# EAGLE design G850L (EAGLE 6.6.0)
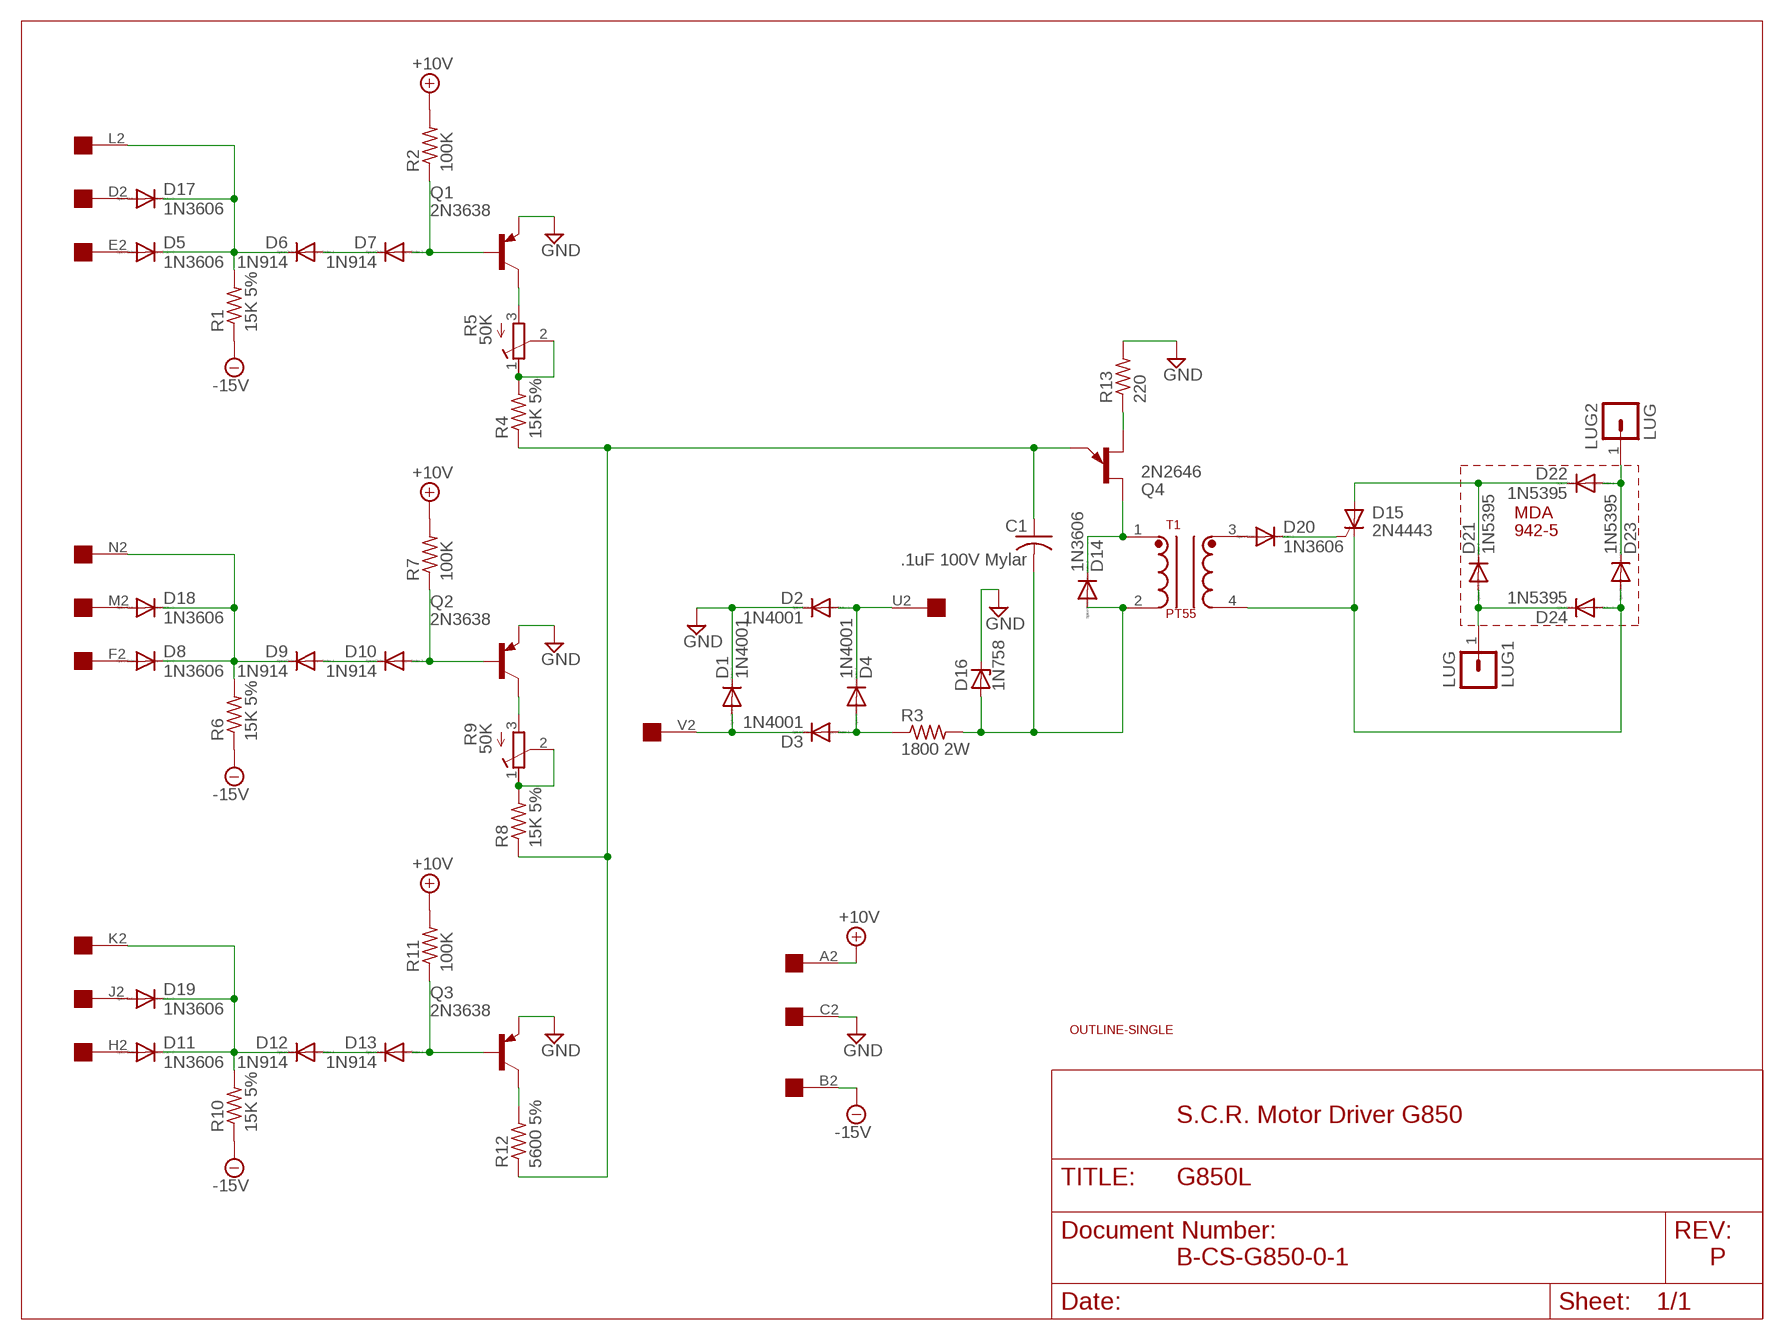
[diagram p0: schematic, sheet 1]

## Parts
C1  .1uF 100V Mylar  C-US275-093X316  [C275-093X316]
D1  1N4001  1N4004  [DO41-10]
D2  1N4001  1N4004  [DO41-10]
D3  1N4001  1N4004  [DO41-10]
D4  1N4001  1N4004  [DO41-10]
D5  1N3606  1N4148DO35-10  [DO35-10]
D6  1N914  1N4148DO35-10  [DO35-10]
D7  1N914  1N4148DO35-10  [DO35-10]
D8  1N3606  1N4148DO35-10  [DO35-10]
D9  1N914  1N4148DO35-10  [DO35-10]
D10  1N914  1N4148DO35-10  [DO35-10]
D11  1N3606  1N4148DO35-10  [DO35-10]
D12  1N914  1N4148DO35-10  [DO35-10]
D13  1N914  1N4148DO35-10  [DO35-10]
D14  1N3606  1N4148DO35-10  [DO35-10]
D15  2N4443  BT151  [TO220CL]
D16  1N758  ZENER-DIODEDO35Z10  [DO35Z10]
D17  1N3606  1N4148DO35-10  [DO35-10]
D18  1N3606  1N4148DO35-10  [DO35-10]
D19  1N3606  1N4148DO35-10  [DO35-10]
D20  1N3606  1N4148DO35-10  [DO35-10]
D21  1N5395  1N4004  [DO41-10]
D22  1N5395  1N4004  [DO41-10]
D23  1N5395  1N4004  [DO41-10]
D24  1N5395  1N4004  [DO41-10]
LUG1  LUG  [SPADELUG]
LUG2  LUG  [SPADELUG]
Q1  2N3638  2N2904  [TO39]
Q2  2N3638  2N2904  [TO39]
Q3  2N3638  2N2904  [TO39]
Q4  2N2646  [TO72I]
R1  15K 5%  R-US_0207/10  [0207/10]
R2  100K  R-US_0207/10  [0207/10]
R3  1800 2W  R-US_0817/22  [P0817/22]
R4  15K 5%  R-US_0207/10  [0207/10]
R5  50K  275P  [3006Y]
R6  15K 5%  R-US_0207/10  [0207/10]
R7  100K  R-US_0207/10  [0207/10]
R8  15K 5%  R-US_0207/10  [0207/10]
R9  50K  275P  [3006Y]
R10  15K 5%  R-US_0207/10  [0207/10]
R11  100K  R-US_0207/10  [0207/10]
R12  5600 5%  R-US_0207/10  [0207/10]
R13  220  R-US_0207/10  [0207/10]
T1  PT55  [PT55]
U$1  OUTLINE-SINGLE  [SINGLE]
U$2  EDGE-1  [EDGE-CON1]

## Nets
+10V: R2.2 R7.2 R11.2 U$2.A2
-15V: R1.1 R6.1 R10.1 U$2.B2
GND [Supply]: D1.C D2.C D16.C Q1.1(E) Q2.1(E) Q3.1(E) R13.2 U$2.C2
N$1: D17.A U$2.D2
N$2: D5.A U$2.E2
N$3: D5.C D6.C D17.C R1.2 U$2.L2
N$4: R4.2 R5.1(A) R5.2(S)
N$5: D9.A D10.C
N$6: Q2.3(C) R9.3(E)
N$7: D10.A Q2.2(B) R7.1
N$8: D8.C D9.C D18.C R6.2 U$2.N2
N$9: R8.2 R9.1(A) R9.2(S)
N$10: D12.A D13.C
N$11: Q3.3(C) R12.2
N$12: D13.A Q3.2(B) R11.1
N$13: D11.C D12.C D19.C R10.2 U$2.K2
N$14: Q1.3(C) R5.3(E)
N$15: D18.A U$2.M2
N$16: D8.A U$2.F2
N$17: D19.A U$2.J2
N$18: D11.A U$2.H2
N$19: C1.1 Q4.E R4.1 R8.1 R12.1
N$20 [Supply]: Q4.B1 R13.1
N$21: D7.A Q1.2(B) R2.1
N$22 [Supply]: C1.2 D14.A D16.A R3.2 T1.2
N$23 [Supply]: D15.C D23.A D24.A T1.4
N$24 [Supply]: D3.A D4.A R3.1
N$25 [Supply]: D2.A D4.C U$2.U2
N$26 [Supply]: D1.A D3.C U$2.V2
N$27 [Supply]: D22.A D23.C LUG2.1
N$28 [Supply]: D21.A D24.C LUG1.1
N$29: D6.A D7.C
N$30 [Supply]: D15.A D21.C D22.C
N$31 [Supply]: D15.G D20.C
N$32 [Supply]: D14.C Q4.B2 T1.1
N$33 [Supply]: D20.A T1.3
Unconnected: U$2.P2 U$2.R2 U$2.S2 U$2.T2

## Notes on the sheet
- MDA
- 942-5
- S.C.R. Motor Driver G850
- B-CS-G850-0-1 | P

## Library data of the parts
C1 = rcl:C-US: CAPACITOR, American symbol
D1-D4 D21-D24 = diode:1N4004: DIODE general purpose rectifier, 1 A
D5-D14 D17-D20 = diode:1N4148: DIODE high speed (Philips)
D15 = triac:BT151: THYRISTOR
D16 = diode:ZENER-DIODE: Z-Diode
LUG1 LUG2 = dec-con:LUG: Spade Lug
Q1-Q3 = transistor-pnp:2N2904*: PNP Transistror
Q4 = transistor-small-signal:2N2646: UNIJUNCTION TRANSISTOR
R1-R4 R6-R8 R10-R13 = rcl:R-US_: RESISTOR, American symbol
R5 R9 = dec-con:275P: Trimpot with 275P (3006Y) footprint.
T1 = dec-con:PT55: PT55 Transformer
U$1 = dec-con:OUTLINE-*: Board outlines for DEC boards.
U$2 = dec-con:EDGE-1: Single-Sided DEC Edge Connector -- (side 2)

## Net classes
1 Supply: width 0.813 mm

## Board
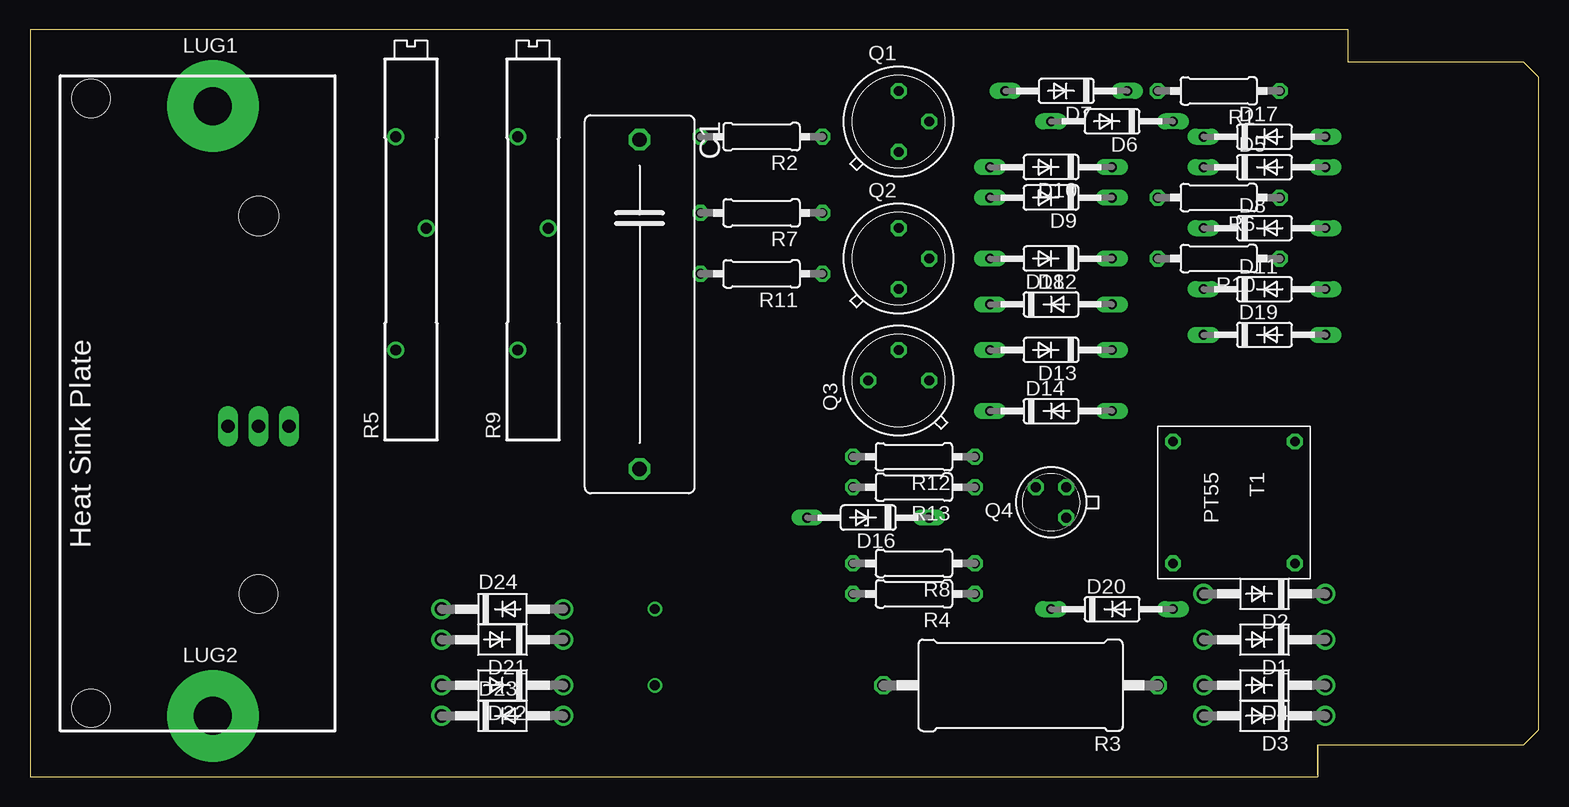
[diagram p1: board, top side]
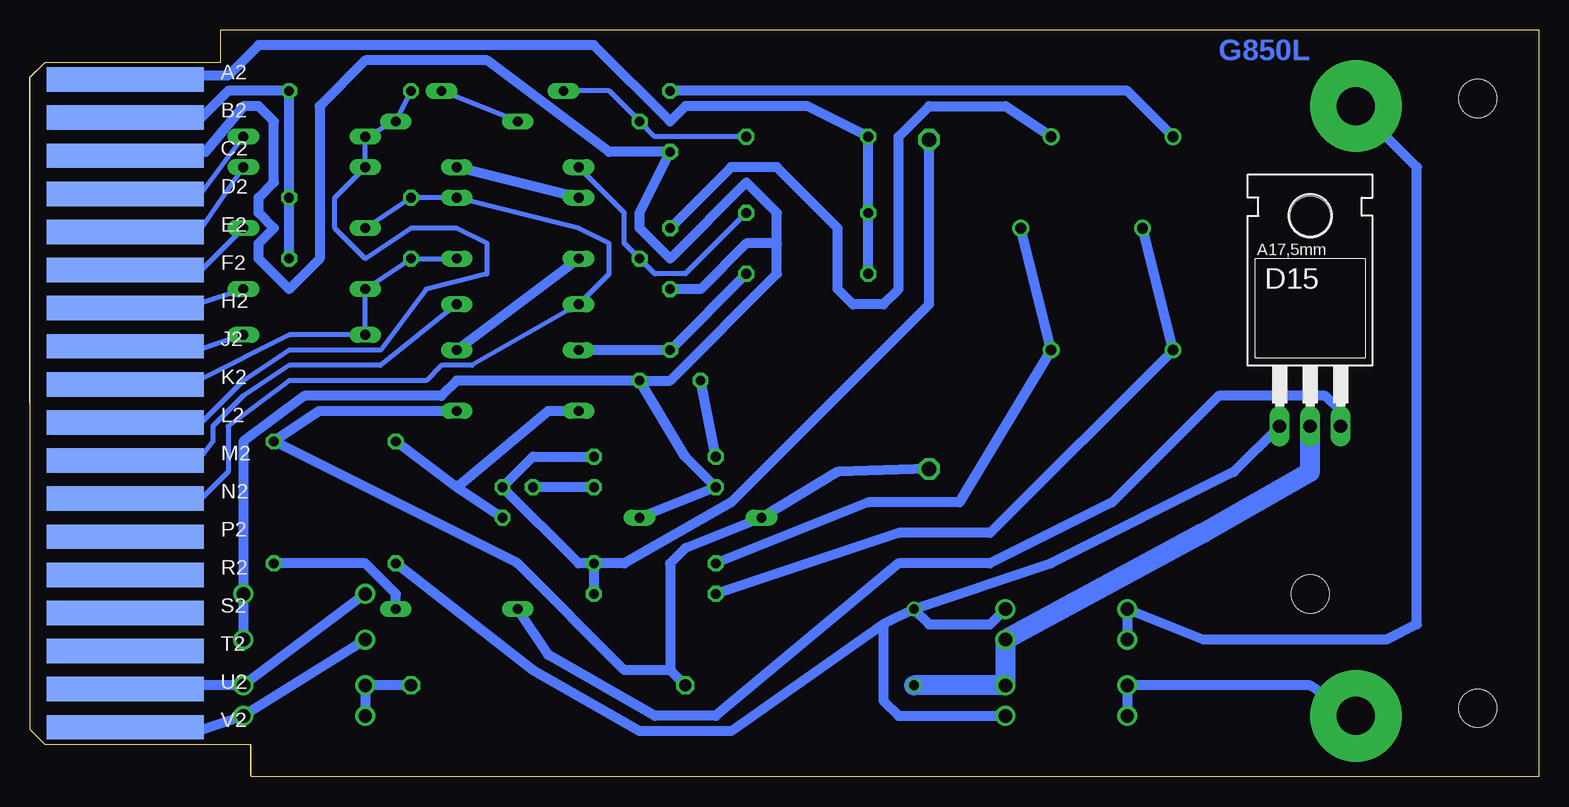
[diagram p2: board, bottom side, seen from below]

Size 125.73 x 62.23 mm. Coordinates in mm from the lower left corner, seen from the top.
Copper layers (1+16): Top 0.035mm / dielectric 1.5mm / Bottom 0.035mm
Design rules "16mils": minimum track width 16mil, minimum drill 32mil, track to track 15mil, track to pad 10mil, pad to pad 10mil, via to via 10mil, smd to smd 10mil, copper to edge 13mil, drill to drill 10mil, minimum pad ring 10mil, minimum via ring 8mil, stop-mask expansion 0mil, vias tented up to drill 0mil, thermal gap 10mil
Holes 3.17 mm at 19.05,15.24

### Footprints (pad centres in the part's own frame; a part is rotated, then mirrored left to right if it is on the bottom)
C275-093X316 = drill 1.194 octagon: 1 -13.716,0; 2 13.716,0
DO41-10 = drill 1.118: A 5.08,0; C -5.08,0
DO35-10 = drill 0.813 long: A 5.08,0; C -5.08,0
TO220CL = drill 1.118 long: A 0,-6.35; C -2.54,-6.35; G 2.54,-6.35 | hole 3.302: 0,11.176
DO35Z10 = drill 0.813 long: A 5.08,0; C -5.08,0
SPADELUG = drill 3.175 pad 7.62: 1 0,0
TO39 = drill 0.813 octagon: 1 0,-2.54; 2 2.54,0; 3 0,2.54
TO72I = drill 0.813 octagon: B1 1.27,-1.27; B2 -1.27,1.27; E -1.27,-1.27
0207/10 = drill 0.813 octagon: 1 -5.08,0; 2 5.08,0
P0817/22 = drill 1.016 octagon: 1 -11.43,0; 2 11.43,0
3006Y = drill 0.9: 1 -8.89,1.27; 2 1.27,-1.27; 3 8.89,1.27
PT55 = drill 0.813 octagon: 1 -5.08,-5.08; 2 -5.08,5.08; 3 5.08,5.08; 4 5.08,-5.08
SINGLE = hole 3.175: 120.65,56.515; 120.65,5.715
EDGE-CON1 = smd 13.106 x 2.032 bottom: A2 7.938,4.128; B2 7.938,7.303; C2 7.938,10.477; D2 7.938,13.652; E2 7.938,16.828; F2 7.938,20.003; H2 7.938,23.177; J2 7.938,26.352; K2 7.938,29.527; L2 7.938,32.703; M2 7.938,35.877; N2 7.938,39.053; P2 7.938,42.227; R2 7.938,45.403; S2 7.938,48.578; T2 7.938,51.752; U2 7.938,54.928; V2 7.938,58.102

### Placement (x,y rotation side)
C1  50.8,39.37 270 top
D1  102.87,11.43 180 top
D2  102.87,15.24 180 top
D3  102.87,5.08 180 top
D4  102.87,7.62 180 top
D5  102.87,50.8 0 top
D6  90.17,54.61 180 top
D7  86.36,57.15 180 top
D8  102.87,45.72 0 top
D9  85.09,48.26 180 top
D10  85.09,50.8 180 top
D11  102.87,40.64 0 top
D12  85.09,43.18 180 top
D13  85.09,35.56 180 top
D14  85.09,30.48 0 top
D15  19.05,35.56 0 bottom
D16  69.85,21.59 180 top
D17  102.87,53.34 0 top
D18  85.09,39.37 0 top
D19  102.87,36.83 0 top
D20  90.17,13.97 0 top
D21  39.37,11.43 180 top
D22  39.37,7.62 180 top
D23  39.37,5.08 0 top
D24  39.37,13.97 0 top
LUG1  15.24,55.88 0 top
LUG2  15.24,5.08 0 top
Q1  72.39,54.61 0 top
Q2  72.39,43.18 0 top
Q3  72.39,33.02 90 top
Q4  85.09,22.86 180 top
R1  99.06,57.15 180 top
R2  60.96,53.34 180 top
R3  82.55,7.62 180 top
R4  73.66,15.24 180 top
R5  31.75,44.45 90 top
R6  99.06,48.26 180 top
R7  60.96,46.99 180 top
R8  73.66,17.78 180 top
R9  41.91,44.45 90 top
R10  99.06,43.18 180 top
R11  60.96,41.91 180 top
R12  73.66,26.67 180 top
R13  73.66,24.13 180 top
T1  100.33,22.86 270 top
U$1  125.73,62.23 180 top
U$2  125.73,62.23 180 top

### Tracks (layer width: path | path; a pad name or v marks a point on that pad's centre or on a via)
+10V
  Bottom 0.813: U$2.A2 115.57,58.42 109.22,58.42 106.68,60.96 78.74,60.96 72.39,54.61 71.12,55.88 60.96,55.88 R2.2 R7.2 R11.2
-15V
  Bottom 0.813: U$2.B2 116.84,54.61 111.76,54.61 109.22,57.15 R1.1 R6.1 R10.1
GND
  Bottom 0.813: D1.C D2.C 107.95,27.94 102.87,31.75 91.44,31.75 90.17,33.02 Q3.1 | U$2.C2 116.84,52.07 111.12,52.07 107.95,55.88 106.68,55.88 105.41,54.61 105.41,49.53 106.68,48.26 106.68,46.99 105.41,45.72 106.68,44.45 106.68,43.18 104.14,40.64 101.6,43.18 101.6,55.88 97.79,59.69 87.63,59.69 77.47,52.07 Q1.1 74.93,46.99 74.93,45.72 72.39,43.18 66.04,49.53 63.5,46.99 63.5,44.45 | D16.C R13.2 71.12,26.67 Q3.1 | Q3.1 72.39,33.02 63.5,41.91 63.5,44.45 | 63.5,44.45 66.04,44.45 69.85,40.64 Q2.1
N$1
  Bottom 0.406: U$2.D2 116.84,48.26 111.76,48.26 D17.A
N$2
  Bottom 0.406: U$2.E2 116.84,45.72 111.44,45.72 D5.A
N$3
  Bottom 0.406: R1.2 D6.C D17.C D5.C 100.33,48.26 100.33,45.72 97.79,43.18 93.98,45.72 90.17,45.72 87.63,44.45 87.63,41.91 92.71,40.64 96.52,35.56 104.14,35.56 107.95,33.02 111.76,29.21 116.84,29.21 U$2.L2
N$4
  Bottom 0.813: R5.2 R5.1 45.72,20.32 53.34,20.32 R4.2
N$5
  Bottom 0.813: D9.A D10.C
N$6
  Bottom 0.813: R9.3 44.45,55.88 50.8,55.88 53.34,53.34 53.34,40.64 54.61,39.37 57.15,39.37 58.42,40.64 58.42,45.72 63.5,50.8 67.31,50.8 Q2.3
N$7
  Bottom 0.406: R7.1 71.12,41.91 73.66,41.91 Q2.2 76.2,44.45 76.2,46.99 D10.A
N$8
  Bottom 0.406: D8.C R6.2 D9.C 80.01,45.72 77.47,44.45 77.47,41.91 D18.C 88.9,34.29 91.44,34.29 92.71,33.02 104.14,33.02 109.22,29.21 109.22,25.4 111.76,22.86 116.84,22.86 U$2.N2
N$9
  Bottom 0.813: R9.2 R9.1 48.26,22.86 55.88,22.86 R8.2
N$10
  Bottom 0.813: D12.A D13.C
N$11
  Bottom 0.813: R12.2 Q3.3
N$12
  Bottom 0.813: D13.A Q3.2 R11.1
N$13
  Bottom 0.406: U$2.K2 116.84,33.02 111.76,33.02 104.14,36.83 D19.C D11.C R10.2 D12.C
N$14
  Bottom 0.813: Q1.3 34.29,57.15 R5.3
N$15
  Bottom 0.406: 116.84,26.67 111.44,26.67 110.49,27.94 110.49,29.21 107.95,31.75 104.14,34.29 96.52,34.29 D18.A
  Bottom 0.813: 116.84,26.67 U$2.M2
N$16
  Bottom 0.406: U$2.F2 116.84,41.91 111.76,41.91 D8.A
N$17
  Bottom 0.406: U$2.J2 116.84,35.56 111.76,35.56 D19.A
N$18
  Bottom 0.406: U$2.H2 116.84,39.37 111.76,39.37 D11.A
N$19
  Bottom 0.813: C1.1 50.8,39.37 67.31,22.86 76.2,17.78 R8.1 | R8.1 R4.1 | R8.1 80.01,17.78 Q4.E 83.82,26.67 R12.1
N$20
  Bottom 0.813: R13.1 Q4.B1
N$21
  Bottom 0.406: R2.1 73.66,53.34 Q1.2 77.47,57.15 D7.A
N$22
  Bottom 0.813: C1.2 58.42,25.4 D16.A 71.12,19.05 72.39,17.78 72.39,8.89 | 72.39,8.89 R3.2 | 72.39,8.89 76.2,8.89 85.09,17.78 T1.2 101.6,30.48 D14.A
N$23  (via drill 0.81)
  Bottom 0.813: D15.C 25.4,25.4 40.64,17.78 v52.07,13.97 | 54.61,12.7 67.31,3.81 74.93,3.81 83.82,8.89 T1.4 | D23.A 53.34,5.08 54.61,6.35 54.61,12.7 | v52.07,13.97 54.61,12.7 | D24.A 45.72,12.7 50.8,12.7 v52.07,13.97
N$24
  Bottom 0.813: R3.1 D4.A D3.A
N$25
  Bottom 0.813: D2.A D4.C 116.84,7.62 U$2.U2
N$26
  Bottom 0.813: D1.A D3.C 111.76,3.81 116.84,3.81 U$2.V2
N$27
  Bottom 0.813: D23.C D22.A 19.05,7.62 LUG2.1
N$28
  Bottom 0.813: D21.A D24.C 27.94,11.43 12.7,11.43 10.16,12.7 10.16,50.8 LUG1.1
N$29
  Bottom 0.406: D6.A D7.C
N$30  (via drill 0.81)
  Bottom 1.676: D15.A 19.05,25.4 27.94,20.32 D21.C D22.C v52.07,7.62
N$31
  Bottom 0.813: D15.G 16.51,30.48 17.78,31.75 26.67,31.75 35.56,22.86 45.72,17.78 53.34,17.78 68.58,5.08 73.66,5.08 82.55,10.16 D20.C
N$32
  Bottom 0.813: Q4.B2 90.17,24.13 | 90.17,24.13 90.08,24.25 | 90.17,24.13 90.08,24.25 | 90.17,24.13 T1.1 | D14.C 82.55,30.48 90.17,24.13 | 90.17,24.13 90.08,24.25
N$33
  Bottom 0.813: D20.A 95.25,15.24 97.79,17.78 T1.3

### Text on the board
Bottom: G850L
tPlace: Heat Sink Plate